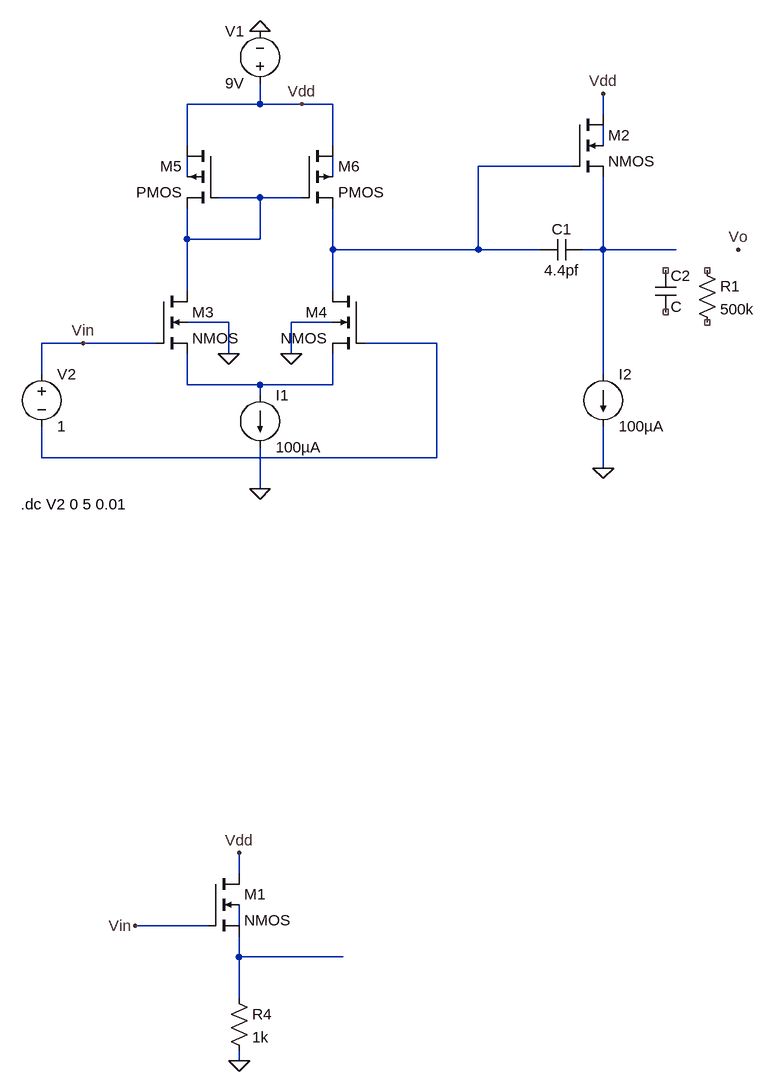
[diagram p0: schematic Draft2.asc]
Draft2.asc, the LTspice schematic file:
Version 4.1
SHEET 1 1024 1476
WIRE 240 -16 240 -48
WIRE 240 -16 128 -16
WIRE 304 -16 240 -16
WIRE 352 -16 304 -16
WIRE 768 0 768 -32
WIRE 128 48 128 -16
WIRE 352 48 352 -16
WIRE 768 48 768 16
WIRE 720 80 576 80
WIRE 128 96 128 64
WIRE 352 96 352 64
WIRE 240 128 176 128
WIRE 304 128 240 128
WIRE 128 192 128 144
WIRE 240 192 240 128
WIRE 240 192 128 192
WIRE 352 208 352 144
WIRE 576 208 576 80
WIRE 576 208 352 208
WIRE 672 208 576 208
WIRE 768 208 768 96
WIRE 768 208 736 208
WIRE 880 208 768 208
WIRE 128 272 128 192
WIRE 352 272 352 208
WIRE 192 320 128 320
WIRE 352 320 288 320
WIRE -32 352 -96 352
WIRE 80 352 -32 352
WIRE 512 352 400 352
WIRE 192 368 192 320
WIRE 288 368 288 320
WIRE -96 400 -96 352
WIRE 768 400 768 208
WIRE 128 416 128 368
WIRE 240 416 128 416
WIRE 352 416 352 368
WIRE 352 416 240 416
WIRE 240 432 240 416
WIRE -96 528 -96 480
WIRE 512 528 512 352
WIRE 512 528 -96 528
WIRE 768 544 768 480
WIRE 240 576 240 512
WIRE 208 1168 208 1136
WIRE 160 1248 48 1248
WIRE 208 1248 208 1216
WIRE 208 1296 208 1264
WIRE 368 1296 208 1296
WIRE 208 1360 208 1296
WIRE 208 1456 208 1440
FLAG 240 576 0
FLAG 240 -128 0
FLAG 192 368 0
FLAG 288 368 0
FLAG 208 1456 0
FLAG 304 -16 Vdd
FLAG 208 1136 Vdd
FLAG -32 352 Vin
FLAG 48 1248 Vin
FLAG 768 -32 Vdd
FLAG 768 544 0
FLAG 976 208 Vo
SYMBOL nmos4 80 272 R0
SYMATTR InstName M3
SYMBOL nmos4 400 272 M0
SYMATTR InstName M4
SYMBOL current 240 432 R0
WINDOW 123 0 0 Left 0
WINDOW 39 0 0 Left 0
SYMATTR InstName I1
SYMATTR Value 100µA
SYMBOL voltage 240 -32 R180
WINDOW 0 24 96 Left 2
WINDOW 3 24 16 Left 2
WINDOW 123 0 0 Left 0
WINDOW 39 0 0 Left 0
SYMATTR InstName V1
SYMATTR Value 9V
SYMBOL voltage -96 384 R0
WINDOW 123 0 0 Left 0
WINDOW 39 0 0 Left 0
SYMATTR InstName V2
SYMATTR Value 1
SYMBOL nmos4 160 1168 R0
SYMATTR InstName M1
SYMBOL res 192 1344 R0
SYMATTR InstName R4
SYMATTR Value 1k
SYMBOL cap 736 192 R90
WINDOW 0 0 32 VBottom 2
WINDOW 3 32 32 VTop 2
SYMATTR InstName C1
SYMATTR Value 4.4pf
SYMBOL nmos4 720 0 R0
SYMATTR InstName M2
SYMBOL current 768 400 R0
WINDOW 123 0 0 Left 0
WINDOW 39 0 0 Left 0
SYMATTR InstName I2
SYMATTR Value 100µA
SYMBOL res 912 224 R0
SYMATTR InstName R1
SYMATTR Value 500k
SYMBOL cap 848 240 R0
SYMATTR InstName C2
SYMBOL pmos4 176 48 M0
SYMATTR InstName M5
SYMBOL pmos4 304 48 R0
SYMATTR InstName M6
TEXT -128 600 Left 2 !.dc V2 0 5 0.01

The netlist it stands for:
* Draft2.asc
M3 N005 Vin N008 0 NMOS
M4 N002 N007 N008 0 NMOS
I1 N008 0 100µA
V1 Vdd 0 9V
V2 Vin N007 1
M1 Vdd Vin N010 N009 NMOS
R4 N010 0 1k
C1 N006 N002 4.4pf
M2 Vdd N002 N006 N001 NMOS
I2 N006 0 100µA
R1 NC_01 NC_02 500k
C2 NC_03 NC_04 C
M5 Vdd N005 N005 N003 PMOS
M6 Vdd N005 N002 N004 PMOS
.model NMOS NMOS
.model PMOS PMOS
.lib standard.mos
.dc V2 0 5 0.01
.backanno
.end